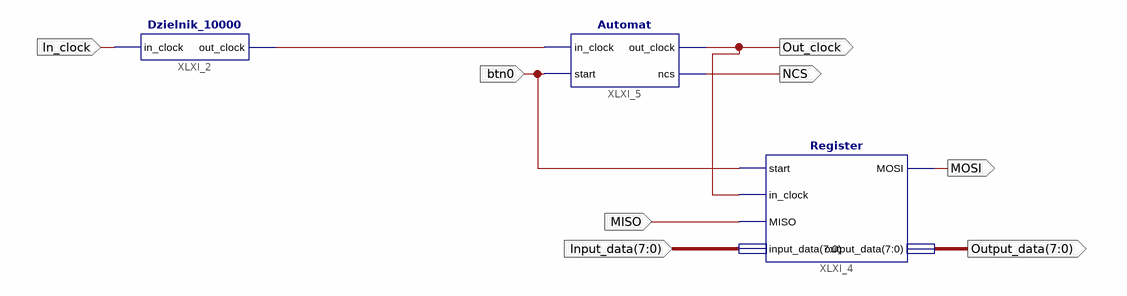
[diagram p0: schematic sheet 1]
// Xilinx ISE schematic SPI_Master.sch (xbr) as structural Verilog: 3 symbols, 8 ports
module SPI_Master (
  input  In_clock,
  input  btn0,
  input  MISO,
  input  [7:0] Input_data,
  output [7:0] Output_data,
  output MOSI,
  output Out_clock,
  output NCS
);

  wire dzielnikwy;

  Dzielnik_10000 XLXI_2 (.in_clock(In_clock), .out_clock(dzielnikwy));
  Register XLXI_4 (
    .start(btn0), .in_clock(Out_clock), .MISO(MISO), .input_data(Input_data), .MOSI(MOSI),
    .output_data(Output_data));
  Automat XLXI_5 (.in_clock(dzielnikwy), .start(btn0), .out_clock(Out_clock), .ncs(NCS));
endmodule
